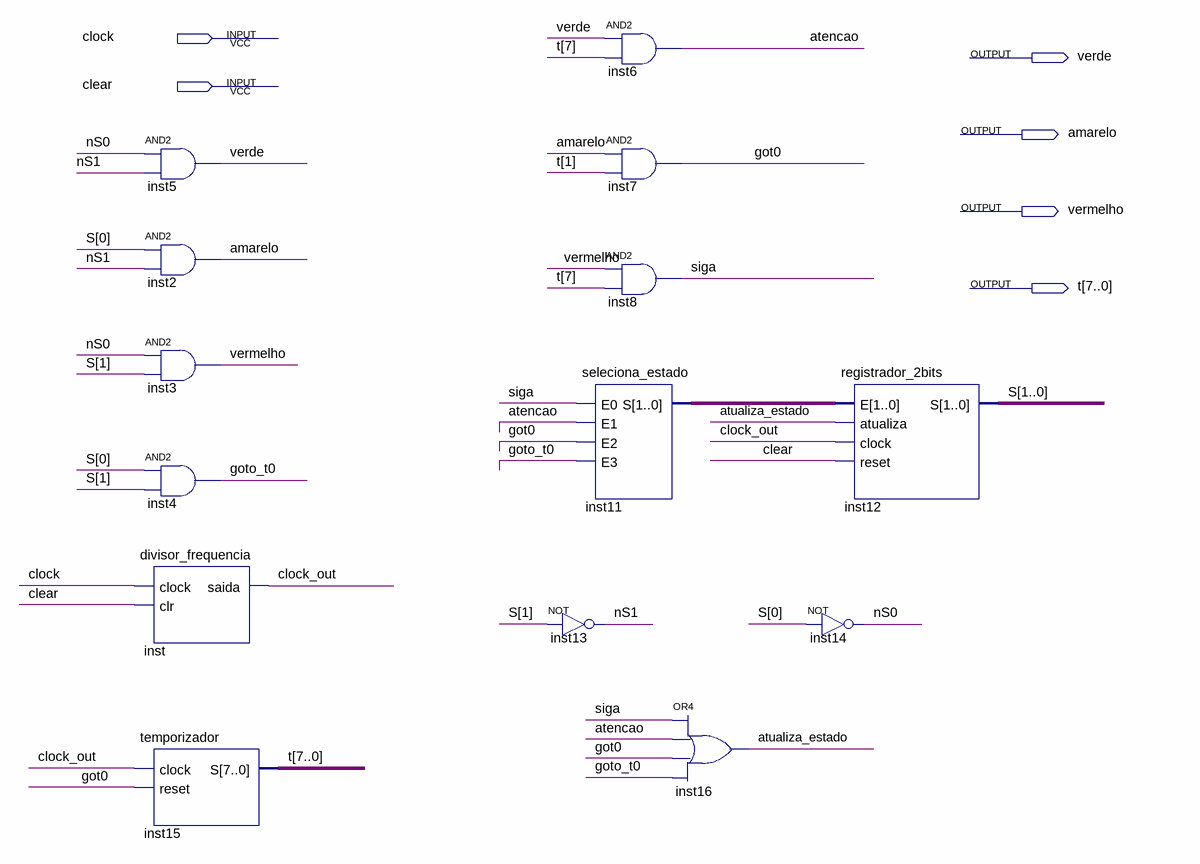
[diagram p0: schematic sheet]
// Quartus schematic lab8.bdf as structural Verilog: 14 symbols, 6 pins
module lab8 (
  input  clock,
  input  clear,
  output verde,
  output amarelo,
  output vermelho,
  output [7:0] t
);

  wire atencao, atualiza_estado, clock_out, got0, goto_t0, nS0, nS1, siga;
  wire [1:0] inst11_s, S;

  and inst5 (verde, nS0, nS1);
  and inst2 (amarelo, S[0], nS1);
  and inst3 (vermelho, nS0, S[1]);
  and inst4 (goto_t0, S[0], S[1]);
  divisor_frequencia inst (.clock(clock), .clr(clear), .saida(clock_out));
  temporizador inst15 (.clock(clock_out), .reset(got0), .S(t));
  seleciona_estado inst11 (.E0(siga), .E1(atencao), .E2(got0), .E3(goto_t0), .S(inst11_s));
  not inst13 (nS1, S[1]);
  and inst6 (atencao, verde, t[7]);
  and inst7 (got0, amarelo, t[1]);
  and inst8 (siga, vermelho, t[7]);
  or inst16 (atualiza_estado, siga, atencao, got0, goto_t0);
  not inst14 (nS0, S[0]);
  registrador_2bits inst12 (.E(inst11_s), .atualiza(atualiza_estado), .clock(clock_out), .reset(clear), .S(S));
endmodule
